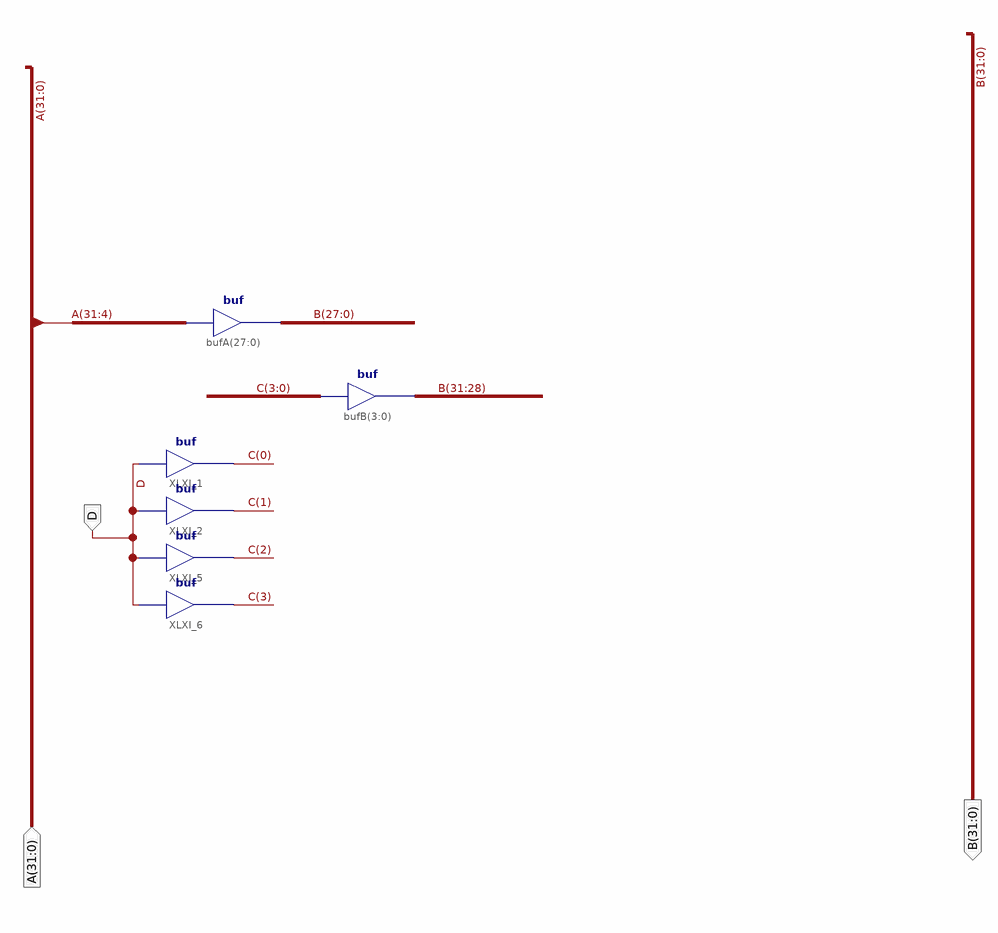
[diagram p0: schematic sheet 1]
// Xilinx ISE schematic shift_4bits.sch (artix7) as structural Verilog: 6 symbols, 3 ports
module shift_4bits (
  input  [31:0] A,
  input  D,
  output [31:0] B
);

  wire [3:0] C;

  assign B[31:28] = C;  // buf bufB[3..0], 4 bits wide
  assign B[27:0] = A[31:4];  // buf bufA[27..0], 28 bits wide
  buf XLXI_1 (C[0], D);
  buf XLXI_2 (C[1], D);
  buf XLXI_5 (C[2], D);
  buf XLXI_6 (C[3], D);
endmodule
